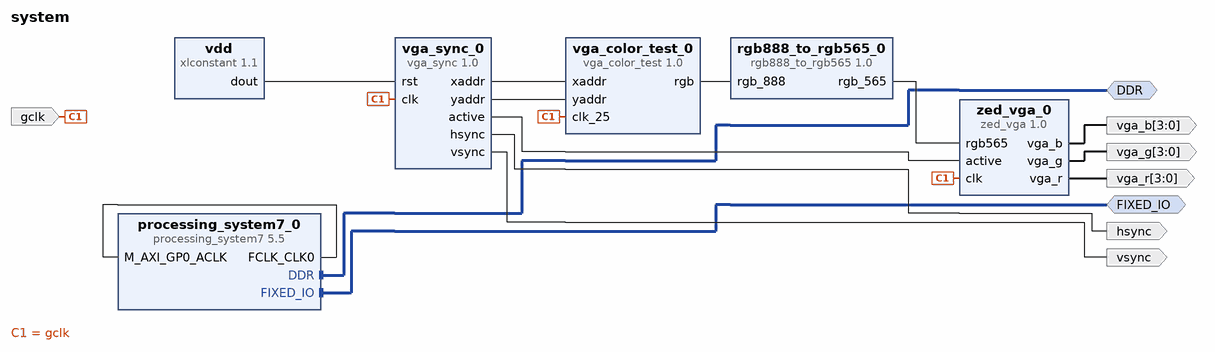
[diagram p0: block diagram of the top level]
# Vivado block design system, xc7z020clg484-1, Vivado 2016.4
create_bd_design system

create_bd_intf_port -mode Master -vlnv xilinx.com:interface:ddrx_rtl:1.0 DDR
create_bd_intf_port -mode Master -vlnv xilinx.com:display_processing_system7:fixedio_rtl:1.0 FIXED_IO
create_bd_port -dir O -from 3 -to 0 vga_r
create_bd_port -dir O -from 3 -to 0 vga_g
create_bd_port -dir O -from 3 -to 0 vga_b
create_bd_port -dir O hsync
create_bd_port -dir O vsync
create_bd_port -dir I gclk

create_bd_cell -type ip -vlnv xilinx.com:user:vga_color_test:1.0 vga_color_test_0
create_bd_cell -type ip -vlnv xilinx.com:user:rgb888_to_rgb565:1.0 rgb888_to_rgb565_0
create_bd_cell -type ip -vlnv xilinx.com:user:vga_sync:1.0 vga_sync_0
create_bd_cell -type ip -vlnv xilinx.com:user:zed_vga:1.0 zed_vga_0
create_bd_cell -type ip -vlnv xilinx.com:ip:xlconstant:1.1 vdd
create_bd_cell -type ip -vlnv xilinx.com:ip:processing_system7:5.5 processing_system7_0
set_property -dict {CONFIG.preset ZedBoard} [get_bd_cells processing_system7_0]

# ---- connections ----

connect_bd_intf_net [get_bd_intf_ports DDR] [get_bd_intf_pins processing_system7_0/DDR]
connect_bd_intf_net [get_bd_intf_ports FIXED_IO] [get_bd_intf_pins processing_system7_0/FIXED_IO]
connect_bd_net [get_bd_pins vga_color_test_0/rgb] [get_bd_pins rgb888_to_rgb565_0/rgb_888]
connect_bd_net [get_bd_pins vga_sync_0/xaddr] [get_bd_pins vga_color_test_0/xaddr]
connect_bd_net [get_bd_pins vga_sync_0/yaddr] [get_bd_pins vga_color_test_0/yaddr]
connect_bd_net [get_bd_pins rgb888_to_rgb565_0/rgb_565] [get_bd_pins zed_vga_0/rgb565]
connect_bd_net [get_bd_pins zed_vga_0/vga_r] [get_bd_ports vga_r]
connect_bd_net [get_bd_pins zed_vga_0/vga_g] [get_bd_ports vga_g]
connect_bd_net [get_bd_pins zed_vga_0/vga_b] [get_bd_ports vga_b]
connect_bd_net -net clk_wiz_0_clk_out1 [get_bd_ports gclk] \
  [get_bd_pins vga_color_test_0/clk_25] [get_bd_pins vga_sync_0/clk] [get_bd_pins zed_vga_0/clk]
connect_bd_net [get_bd_pins vga_sync_0/active] [get_bd_pins zed_vga_0/active]
connect_bd_net [get_bd_pins vga_sync_0/hsync] [get_bd_ports hsync]
connect_bd_net [get_bd_pins vga_sync_0/vsync] [get_bd_ports vsync]
connect_bd_net [get_bd_pins vdd/dout] [get_bd_pins vga_sync_0/rst]
connect_bd_net [get_bd_pins processing_system7_0/FCLK_CLK0] [get_bd_pins processing_system7_0/M_AXI_GP0_ACLK]

validate_bd_design
save_bd_design
